# EAGLE schematic slice_v6_zp (EAGLE 7.4.0)
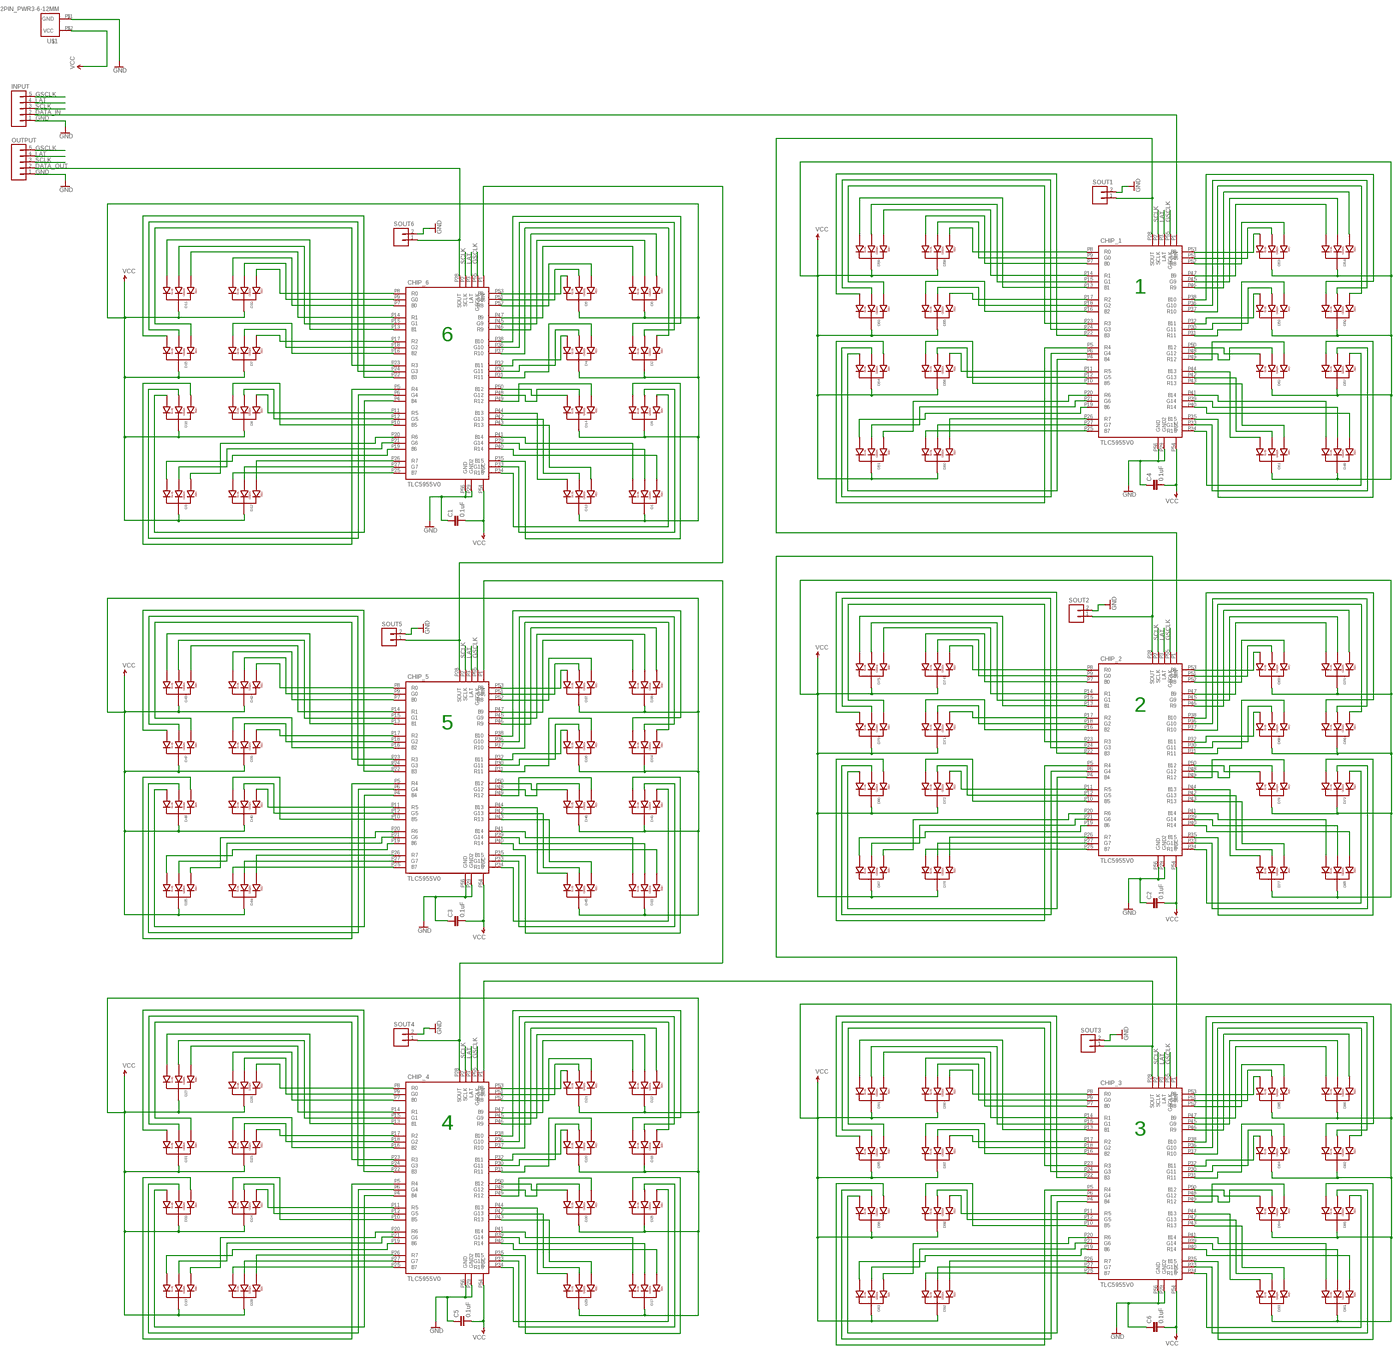
[diagram p0: schematic, sheet 1, overview]
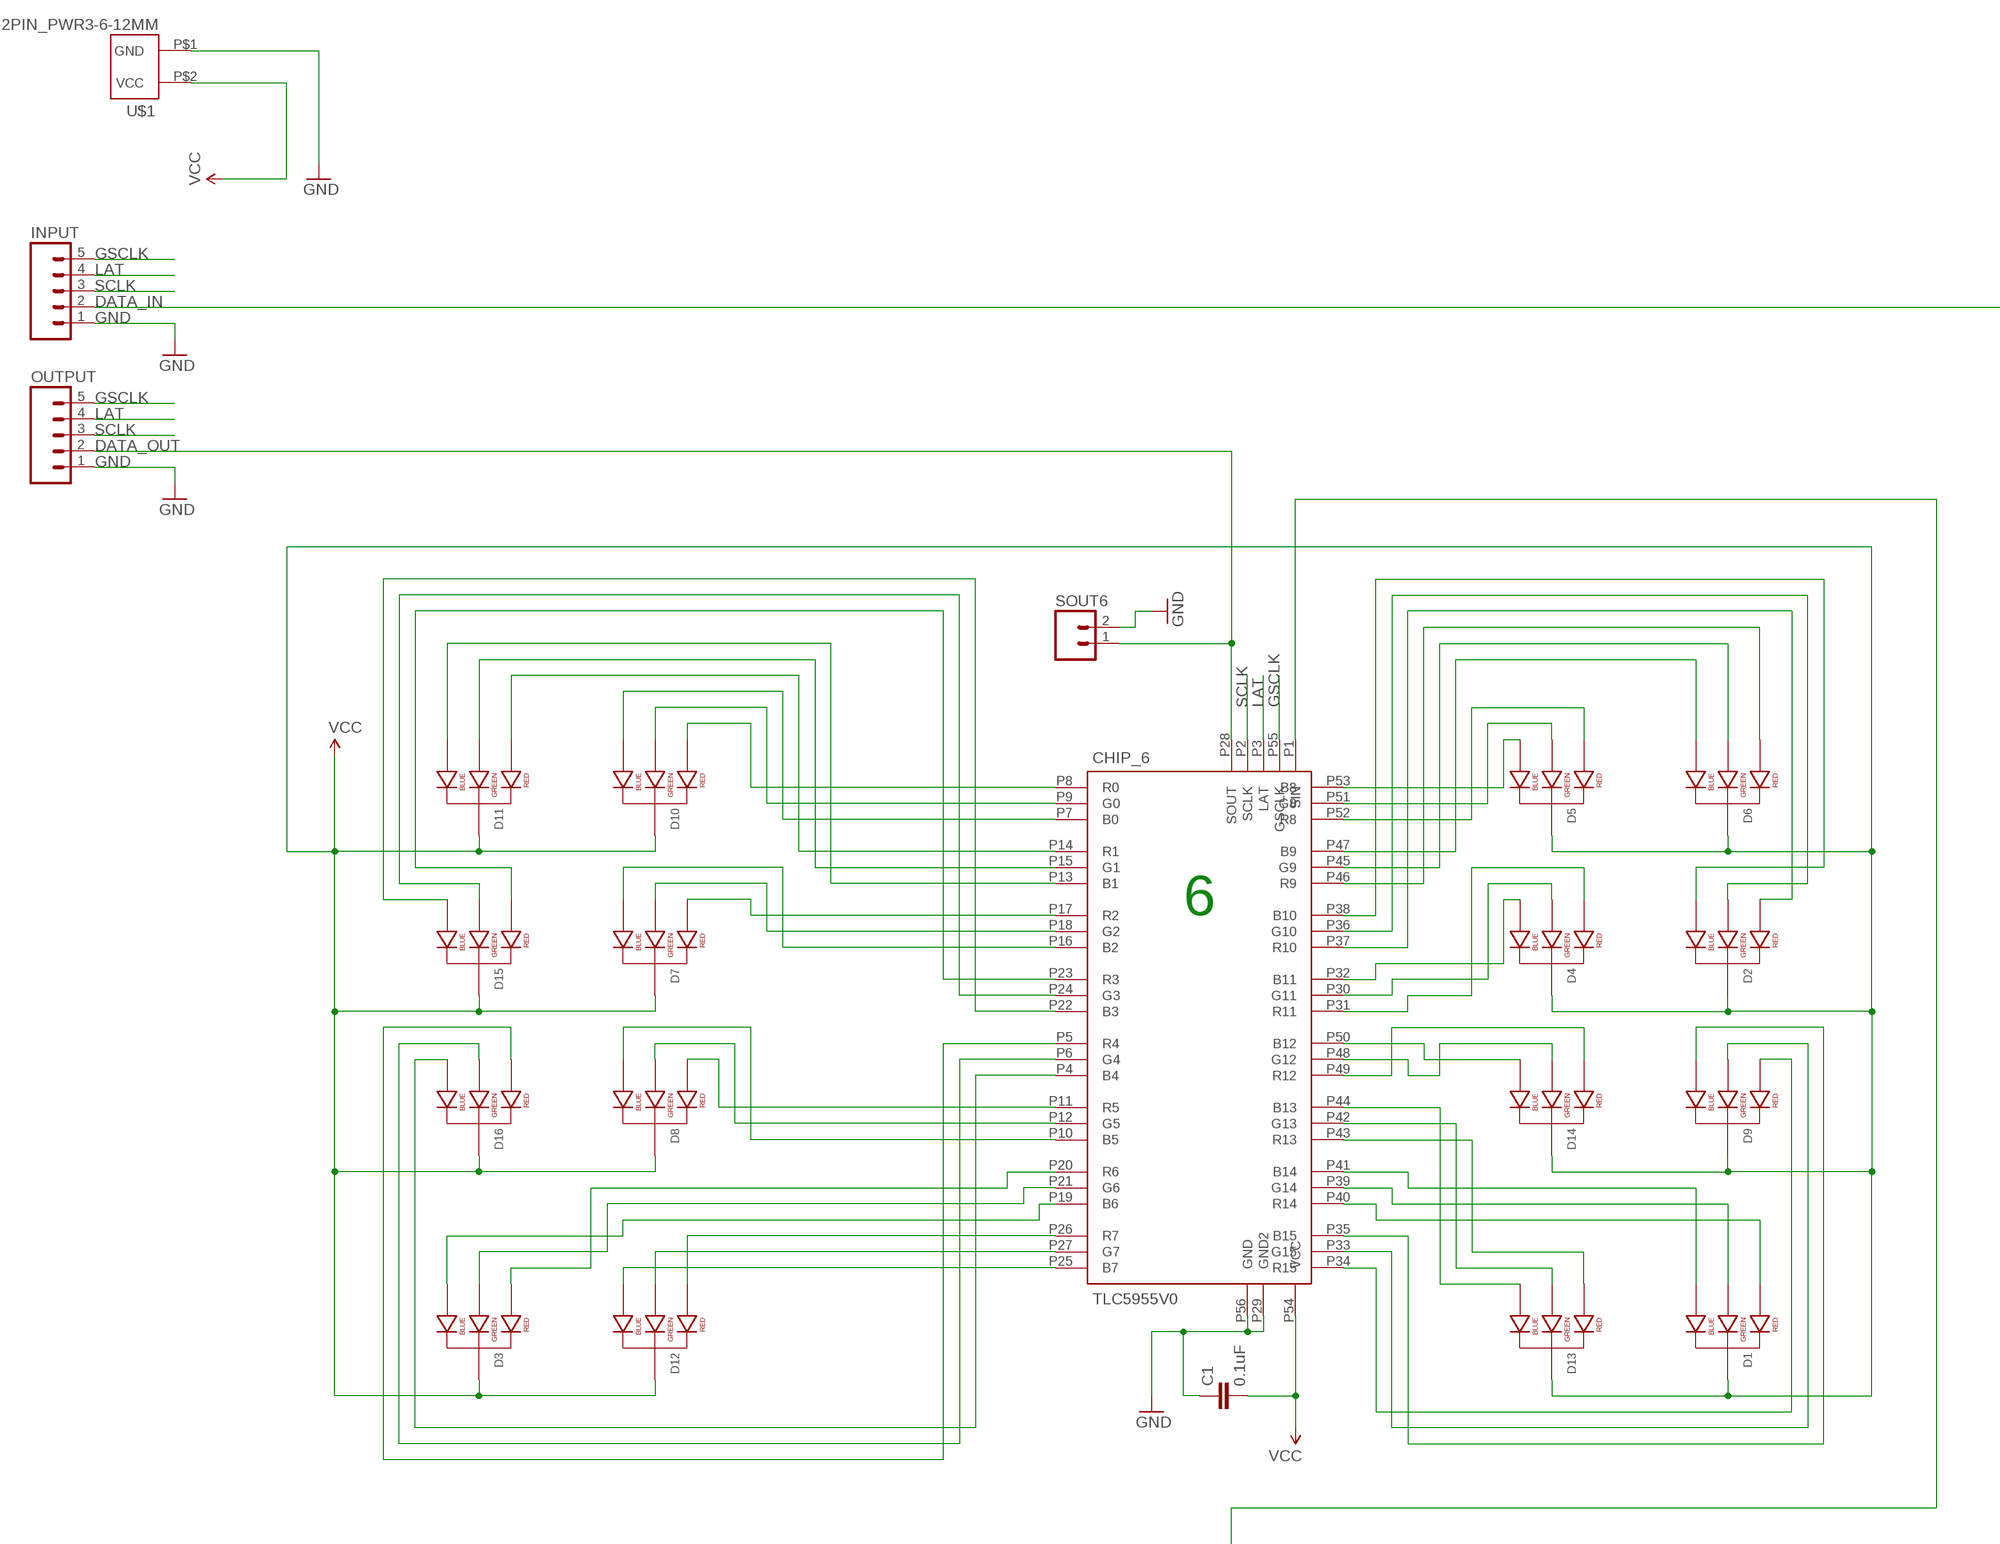
[diagram p1: schematic, sheet 1, part 1 of 4]
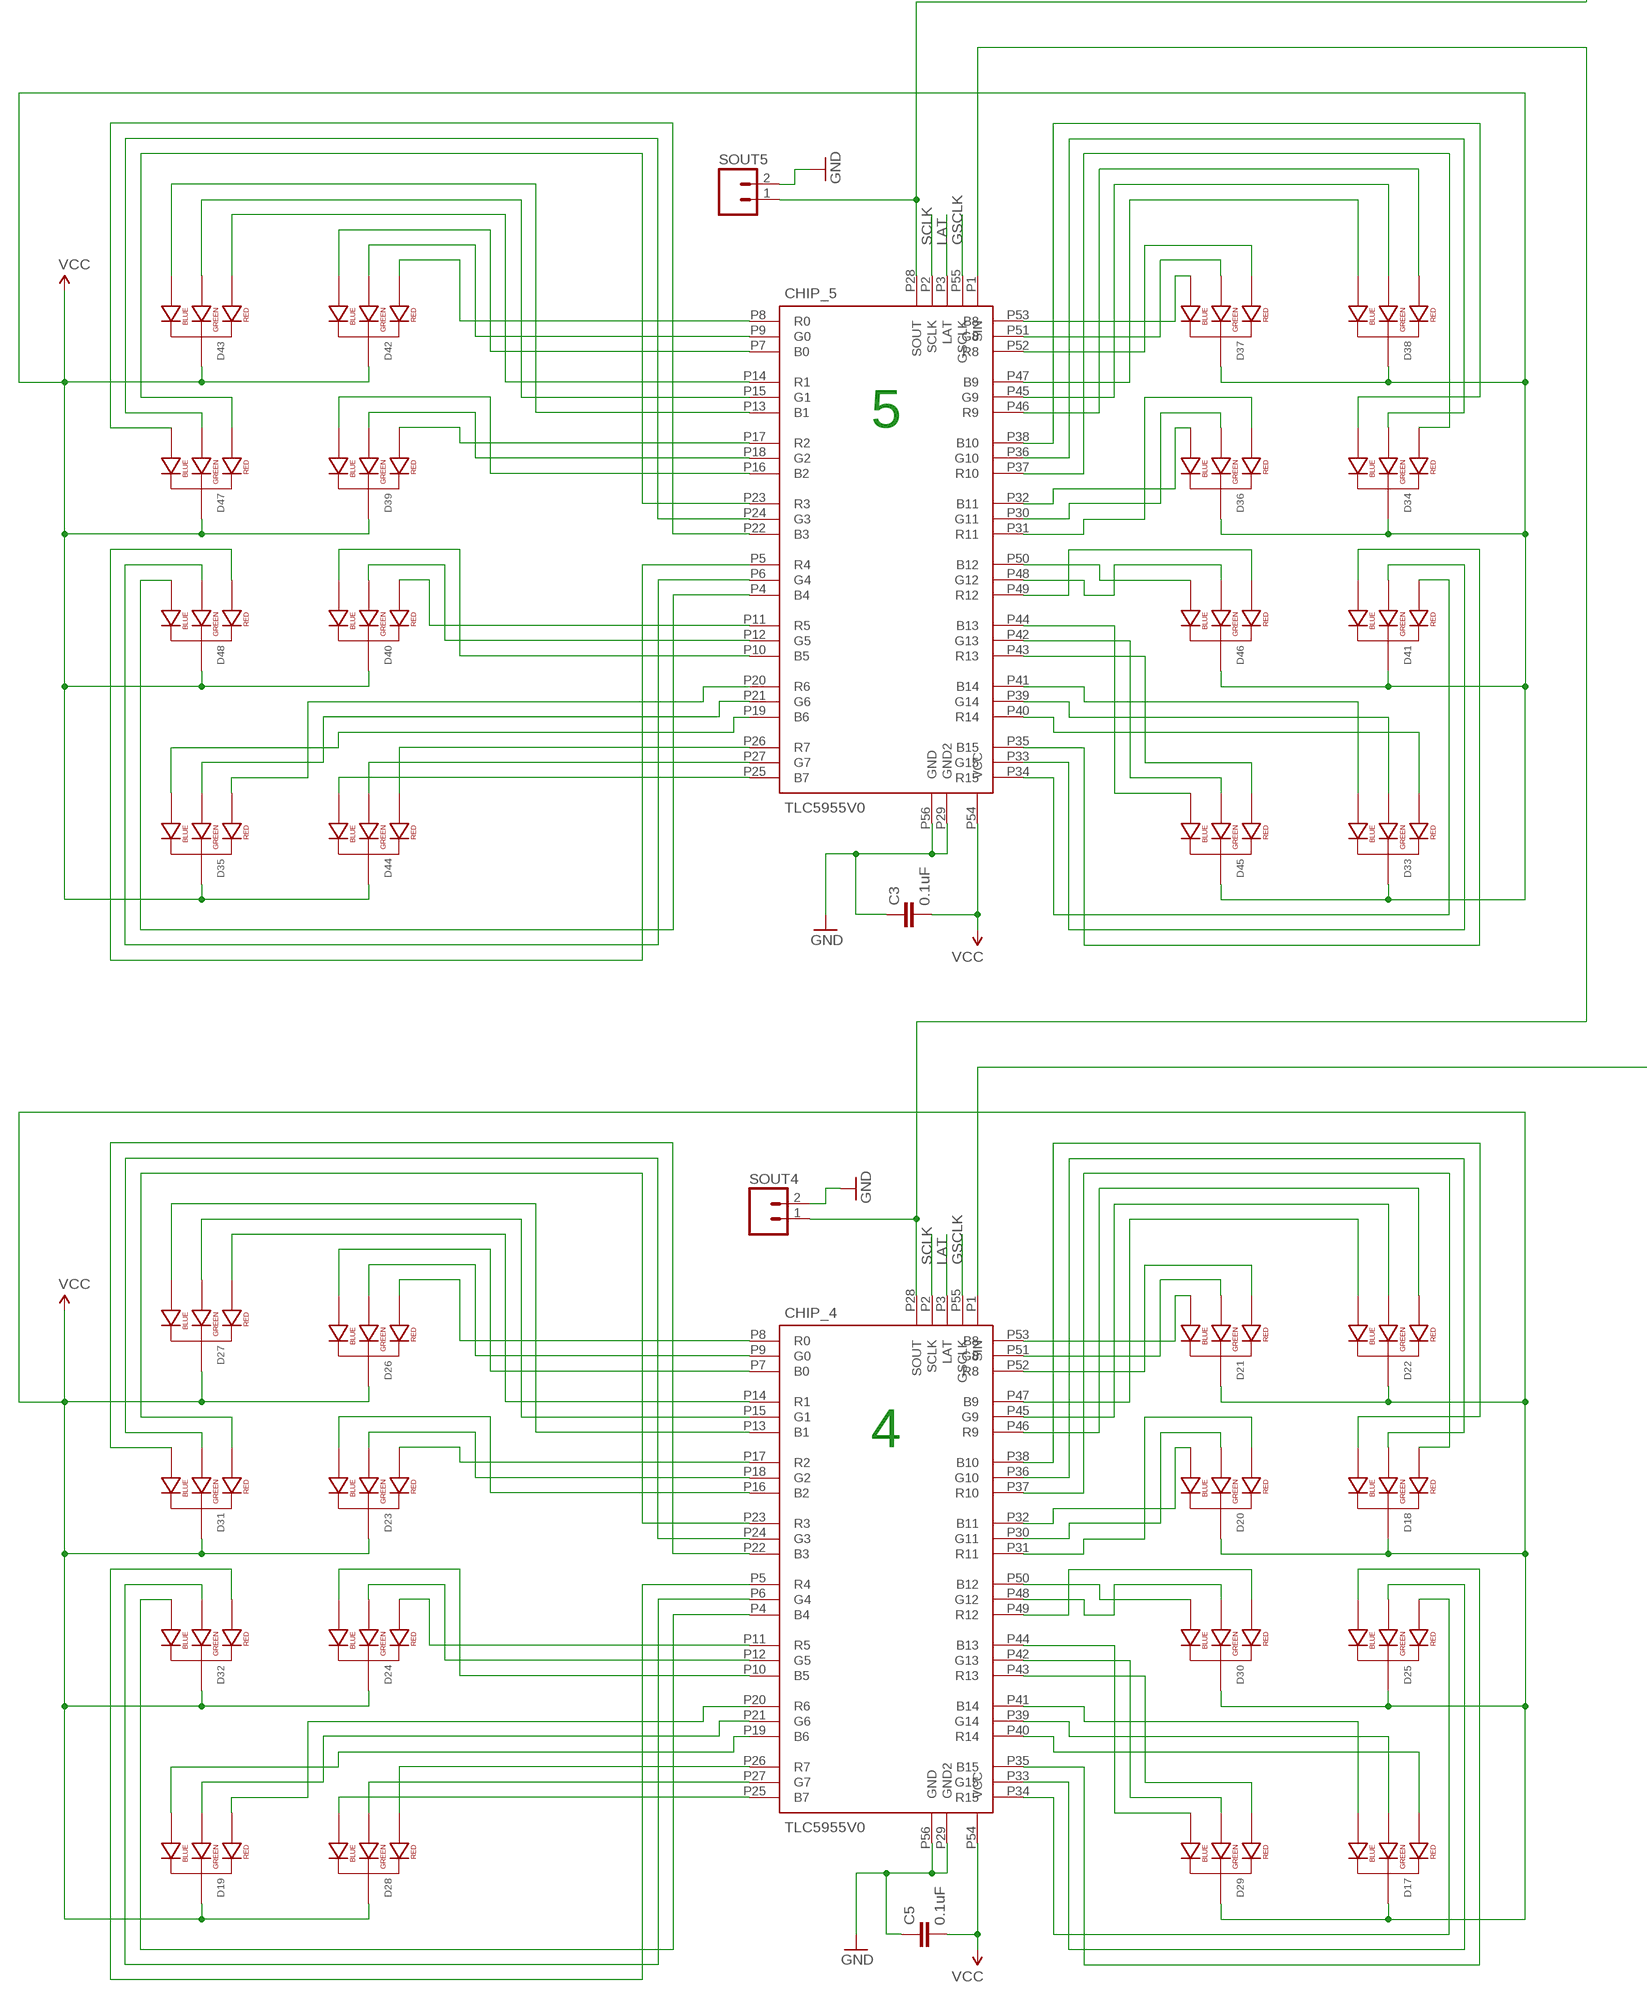
[diagram p2: schematic, sheet 1, part 2 of 4]
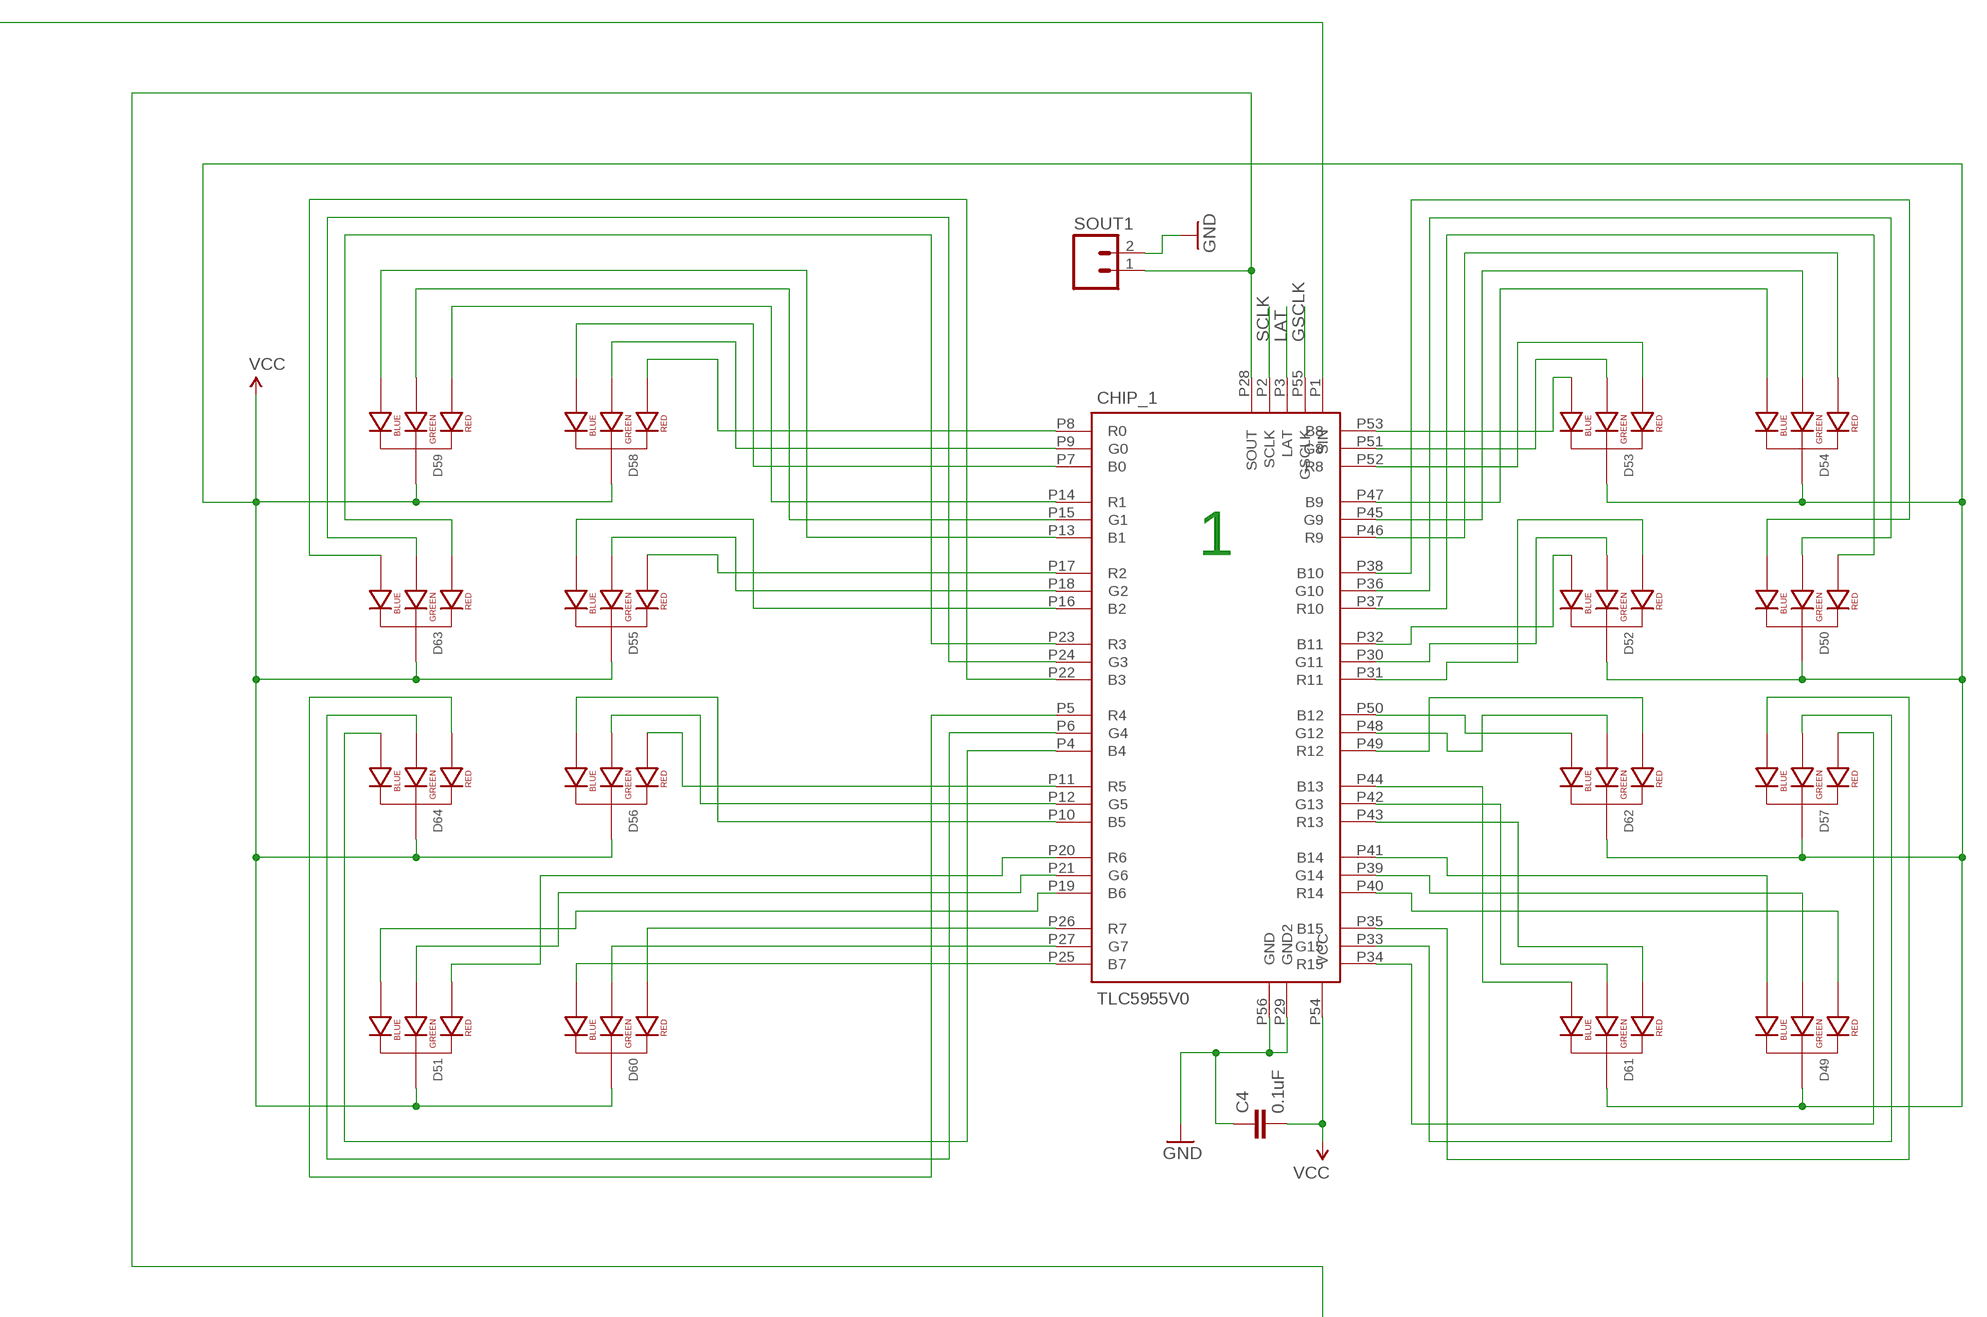
[diagram p3: schematic, sheet 1, part 3 of 4]
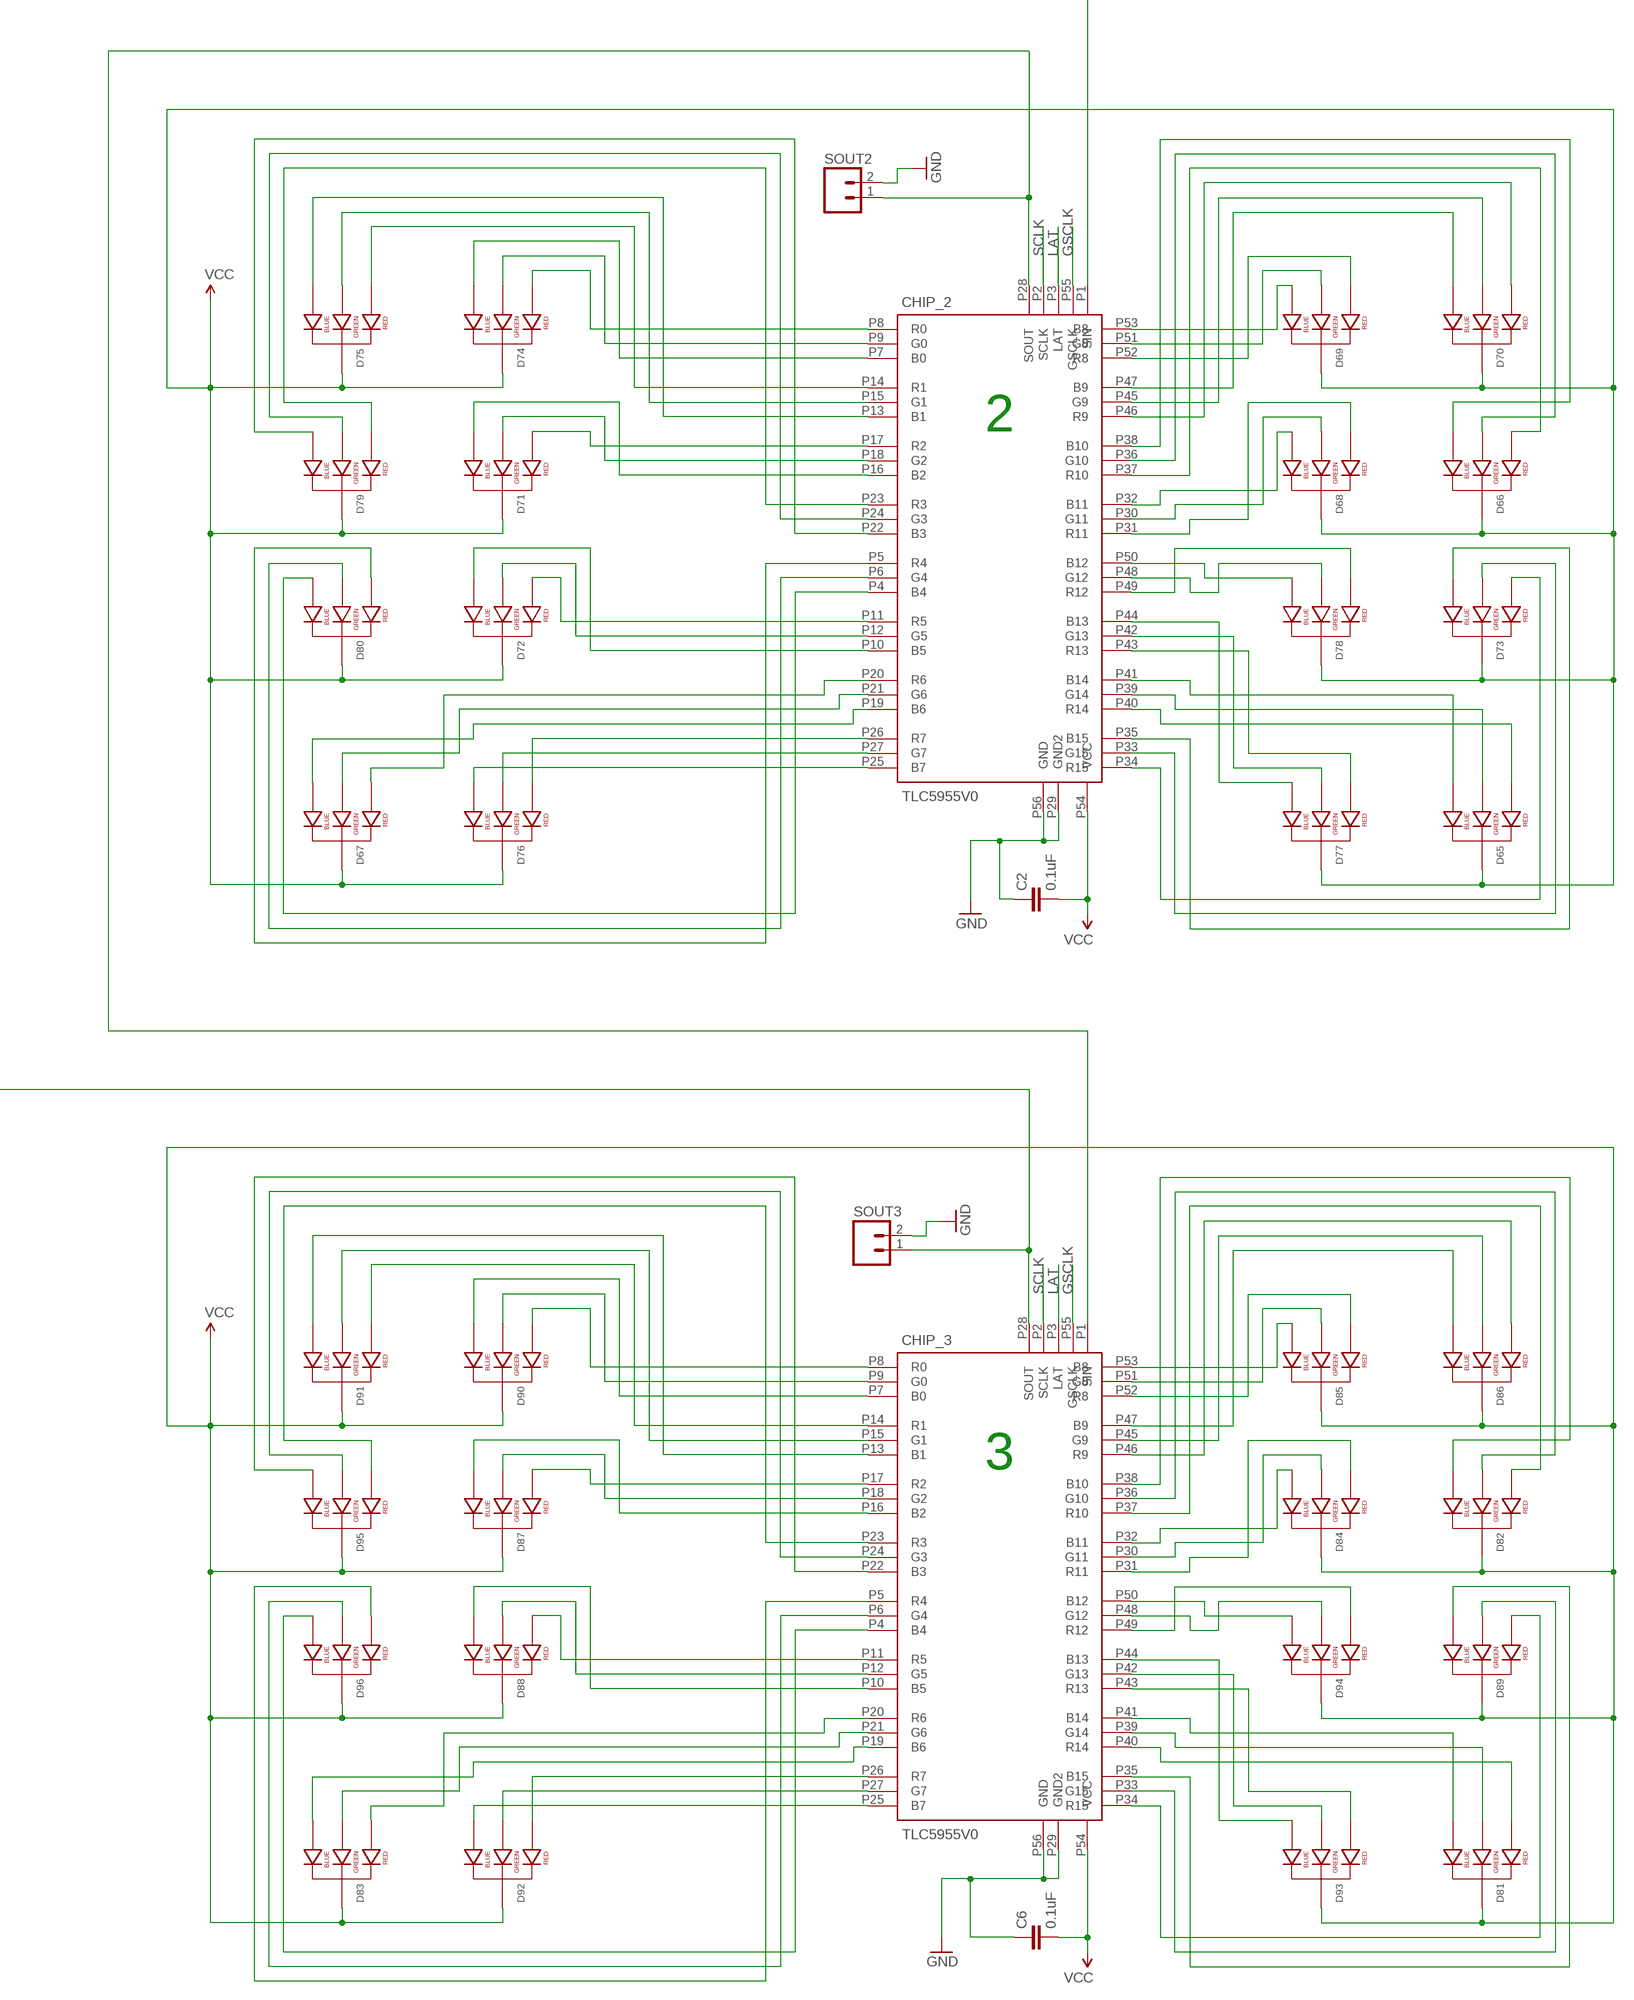
[diagram p4: schematic, sheet 1, part 4 of 4]

## Parts
C1  0.1uF  0.1UF-25V(+80/-20%)(0603)  [0603-CAP]
C2  0.1uF  0.1UF-25V(+80/-20%)(0603)  [0603-CAP]
C3  0.1uF  0.1UF-25V(+80/-20%)(0603)  [0603-CAP]
C4  0.1uF  0.1UF-25V(+80/-20%)(0603)  [0603-CAP]
C5  0.1uF  0.1UF-25V(+80/-20%)(0603)  [0603-CAP]
C6  0.1uF  0.1UF-25V(+80/-20%)(0603)  [0603-CAP]
CHIP_1  TLC5955V0  [56-HTSSOP]
CHIP_2  TLC5955V0  [56-HTSSOP]
CHIP_3  TLC5955V0  [56-HTSSOP]
CHIP_4  TLC5955V0  [56-HTSSOP]
CHIP_5  TLC5955V0  [56-HTSSOP]
CHIP_6  TLC5955V0  [56-HTSSOP]
D1  LED-RGB-CC-THRUCLEAR  [LED-RGB-THRU]
D2  LED-RGB-CC-THRUCLEAR  [LED-RGB-THRU]
D3  LED-RGB-CC-THRUCLEAR  [LED-RGB-THRU]
D4  LED-RGB-CC-THRUCLEAR  [LED-RGB-THRU]
D5  LED-RGB-CC-THRUCLEAR  [LED-RGB-THRU]
D6  LED-RGB-CC-THRUCLEAR  [LED-RGB-THRU]
D7  LED-RGB-CC-THRUCLEAR  [LED-RGB-THRU]
D8  LED-RGB-CC-THRUCLEAR  [LED-RGB-THRU]
D9  LED-RGB-CC-THRUCLEAR  [LED-RGB-THRU]
D10  LED-RGB-CC-THRUCLEAR  [LED-RGB-THRU]
D11  LED-RGB-CC-THRUDIFFUSE  LED-RGB-CC-THRUCLEAR  [LED-RGB-THRU]
D12  LED-RGB-CC-THRUCLEAR  [LED-RGB-THRU]
D13  LED-RGB-CC-THRUCLEAR  [LED-RGB-THRU]
D14  LED-RGB-CC-THRUCLEAR  [LED-RGB-THRU]
D15  LED-RGB-CC-THRUCLEAR  [LED-RGB-THRU]
D16  LED-RGB-CC-THRUCLEAR  [LED-RGB-THRU]
D17  LED-RGB-CC-THRUCLEAR  [LED-RGB-THRU]
D18  LED-RGB-CC-THRUCLEAR  [LED-RGB-THRU]
D19  LED-RGB-CC-THRUCLEAR  [LED-RGB-THRU]
D20  LED-RGB-CC-THRUCLEAR  [LED-RGB-THRU]
D21  LED-RGB-CC-THRUCLEAR  [LED-RGB-THRU]
D22  LED-RGB-CC-THRUCLEAR  [LED-RGB-THRU]
D23  LED-RGB-CC-THRUCLEAR  [LED-RGB-THRU]
D24  LED-RGB-CC-THRUCLEAR  [LED-RGB-THRU]
D25  LED-RGB-CC-THRUCLEAR  [LED-RGB-THRU]
D26  LED-RGB-CC-THRUCLEAR  [LED-RGB-THRU]
D27  LED-RGB-CC-THRUCLEAR  [LED-RGB-THRU]
D28  LED-RGB-CC-THRUCLEAR  [LED-RGB-THRU]
D29  LED-RGB-CC-THRUCLEAR  [LED-RGB-THRU]
D30  LED-RGB-CC-THRUCLEAR  [LED-RGB-THRU]
D31  LED-RGB-CC-THRUCLEAR  [LED-RGB-THRU]
D32  LED-RGB-CC-THRUCLEAR  [LED-RGB-THRU]
D33  LED-RGB-CC-THRUCLEAR  [LED-RGB-THRU]
D34  LED-RGB-CC-THRUCLEAR  [LED-RGB-THRU]
D35  1  LED-RGB-CC-THRUCLEAR  [LED-RGB-THRU]
D36  LED-RGB-CC-THRUCLEAR  [LED-RGB-THRU]
D37  LED-RGB-CC-THRUCLEAR  [LED-RGB-THRU]
D38  LED-RGB-CC-THRUCLEAR  [LED-RGB-THRU]
D39  LED-RGB-CC-THRUCLEAR  [LED-RGB-THRU]
D40  LED-RGB-CC-THRUCLEAR  [LED-RGB-THRU]
D41  LED-RGB-CC-THRUCLEAR  [LED-RGB-THRU]
D42  LED-RGB-CC-THRUCLEAR  [LED-RGB-THRU]
D43  LED-RGB-CC-THRUCLEAR  [LED-RGB-THRU]
D44  LED-RGB-CC-THRUCLEAR  [LED-RGB-THRU]
D45  LED-RGB-CC-THRUCLEAR  [LED-RGB-THRU]
D46  LED-RGB-CC-THRUCLEAR  [LED-RGB-THRU]
D47  LED-RGB-CC-THRUCLEAR  [LED-RGB-THRU]
D48  LED-RGB-CC-THRUCLEAR  [LED-RGB-THRU]
D49  LED-RGB-CC-THRUCLEAR  [LED-RGB-THRU]
D50  LED-RGB-CC-THRUCLEAR  [LED-RGB-THRU]
D51  LED-RGB-CC-THRUCLEAR  [LED-RGB-THRU]
D52  LED-RGB-CC-THRUCLEAR  [LED-RGB-THRU]
D53  LED-RGB-CC-THRUCLEAR  [LED-RGB-THRU]
D54  LED-RGB-CC-THRUCLEAR  [LED-RGB-THRU]
D55  LED-RGB-CC-THRUCLEAR  [LED-RGB-THRU]
D56  LED-RGB-CC-THRUCLEAR  [LED-RGB-THRU]
D57  LED-RGB-CC-THRUCLEAR  [LED-RGB-THRU]
D58  LED-RGB-CC-THRUCLEAR  [LED-RGB-THRU]
D59  LED-RGB-CC-THRUCLEAR  [LED-RGB-THRU]
D60  LED-RGB-CC-THRUCLEAR  [LED-RGB-THRU]
D61  LED-RGB-CC-THRUCLEAR  [LED-RGB-THRU]
D62  LED-RGB-CC-THRUCLEAR  [LED-RGB-THRU]
D63  LED-RGB-CC-THRUCLEAR  [LED-RGB-THRU]
D64  LED-RGB-CC-THRUCLEAR  [LED-RGB-THRU]
D65  LED-RGB-CC-THRUCLEAR  [LED-RGB-THRU]
D66  LED-RGB-CC-THRUCLEAR  [LED-RGB-THRU]
D67  LED-RGB-CC-THRUCLEAR  [LED-RGB-THRU]
D68  LED-RGB-CC-THRUCLEAR  [LED-RGB-THRU]
D69  LED-RGB-CC-THRUCLEAR  [LED-RGB-THRU]
D70  LED-RGB-CC-THRUCLEAR  [LED-RGB-THRU]
D71  LED-RGB-CC-THRUCLEAR  [LED-RGB-THRU]
D72  LED-RGB-CC-THRUCLEAR  [LED-RGB-THRU]
D73  LED-RGB-CC-THRUCLEAR  [LED-RGB-THRU]
D74  LED-RGB-CC-THRUCLEAR  [LED-RGB-THRU]
D75  LED-RGB-CC-THRUCLEAR  [LED-RGB-THRU]
D76  LED-RGB-CC-THRUCLEAR  [LED-RGB-THRU]
D77  LED-RGB-CC-THRUCLEAR  [LED-RGB-THRU]
D78  LED-RGB-CC-THRUCLEAR  [LED-RGB-THRU]
D79  LED-RGB-CC-THRUCLEAR  [LED-RGB-THRU]
D80  LED-RGB-CC-THRUCLEAR  [LED-RGB-THRU]
D81  LED-RGB-CC-THRUCLEAR  [LED-RGB-THRU]
D82  LED-RGB-CC-THRUCLEAR  [LED-RGB-THRU]
D83  LED-RGB-CC-THRUCLEAR  [LED-RGB-THRU]
D84  LED-RGB-CC-THRUCLEAR  [LED-RGB-THRU]
D85  LED-RGB-CC-THRUCLEAR  [LED-RGB-THRU]
D86  LED-RGB-CC-THRUCLEAR  [LED-RGB-THRU]
D87  LED-RGB-CC-THRUCLEAR  [LED-RGB-THRU]
D88  LED-RGB-CC-THRUCLEAR  [LED-RGB-THRU]
D89  LED-RGB-CC-THRUCLEAR  [LED-RGB-THRU]
D90  LED-RGB-CC-THRUCLEAR  [LED-RGB-THRU]
D91  LED-RGB-CC-THRUCLEAR  [LED-RGB-THRU]
D92  LED-RGB-CC-THRUCLEAR  [LED-RGB-THRU]
D93  LED-RGB-CC-THRUCLEAR  [LED-RGB-THRU]
D94  LED-RGB-CC-THRUCLEAR  [LED-RGB-THRU]
D95  LED-RGB-CC-THRUCLEAR  [LED-RGB-THRU]
D96  LED-RGB-CC-THRUCLEAR  [LED-RGB-THRU]
INPUT  M05LOCK_LONGPADS  [1X05_LOCK_LONGPADS]
OUTPUT  M05LOCK_LONGPADS  [1X05_LOCK_LONGPADS]
SOUT1  M02LOCK  [1X02_LOCK]
SOUT2  M02LOCK  [1X02_LOCK]
SOUT3  M02LOCK  [1X02_LOCK]
SOUT4  M02LOCK  [1X02_LOCK]
SOUT5  M02LOCK  [1X02_LOCK]
SOUT6  M02LOCK  [1X02_LOCK]
U$1  2PIN_PWR3-6-12MM  [2PIN_HOLES_PWR]

## Nets
DATA_IN: CHIP_1.P1(SIN) INPUT.2
DATA_OUT: CHIP_6.P28(SOUT) OUTPUT.2 SOUT6.1
GND: C1.1 C2.1 C3.1 C4.1 C5.1 C6.1 CHIP_1.P29(GND2) CHIP_1.P56(GND) CHIP_2.P29(GND2) CHIP_2.P56(GND) CHIP_3.P29(GND2) CHIP_3.P56(GND) CHIP_4.P29(GND2) CHIP_4.P56(GND) CHIP_5.P29(GND2) CHIP_5.P56(GND) CHIP_6.P29(GND2) CHIP_6.P56(GND) INPUT.1 OUTPUT.1 SOUT1.2 SOUT2.2 SOUT3.2 SOUT4.2 SOUT5.2 SOUT6.2 U$1.P$1(GND)
GSCLK: CHIP_1.P55(GSCLK) CHIP_2.P55(GSCLK) CHIP_3.P55(GSCLK) CHIP_4.P55(GSCLK) CHIP_5.P55(GSCLK) CHIP_6.P55(GSCLK) INPUT.5 OUTPUT.5
LAT: CHIP_1.P3(LAT) CHIP_2.P3(LAT) CHIP_3.P3(LAT) CHIP_4.P3(LAT) CHIP_5.P3(LAT) CHIP_6.P3(LAT) INPUT.4 OUTPUT.4
N$1: CHIP_6.P8(R0) D10.3(RED_CATHODE)
N$2: CHIP_6.P20(R6) D3.3(RED_CATHODE)
N$3: CHIP_6.P7(B0) D10.4(BLUE_CATHODE)
N$4: CHIP_6.P17(R2) D7.3(RED_CATHODE)
N$5: CHIP_6.P18(G2) D7.1(GREEN_CATHODE)
N$6: CHIP_6.P16(B2) D7.4(BLUE_CATHODE)
N$7: CHIP_6.P14(R1) D11.3(RED_CATHODE)
N$8: CHIP_6.P34(R15) D9.3(RED_CATHODE)
N$9: CHIP_6.P15(G1) D11.1(GREEN_CATHODE)
N$10: CHIP_6.P13(B1) D11.4(BLUE_CATHODE)
N$11: CHIP_6.P26(R7) D12.3(RED_CATHODE)
N$12: CHIP_6.P27(G7) D12.1(GREEN_CATHODE)
N$13: CHIP_6.P25(B7) D12.4(BLUE_CATHODE)
N$14: CHIP_6.P11(R5) D8.3(RED_CATHODE)
N$15: CHIP_6.P12(G5) D8.1(GREEN_CATHODE)
N$16: CHIP_6.P10(B5) D8.4(BLUE_CATHODE)
N$17: CHIP_6.P21(G6) D3.1(GREEN_CATHODE)
N$18: CHIP_6.P19(B6) D3.4(BLUE_CATHODE)
N$19: CHIP_6.P4(B4) D16.4(BLUE_CATHODE)
N$20: CHIP_6.P6(G4) D16.1(GREEN_CATHODE)
N$21: CHIP_6.P5(R4) D16.3(RED_CATHODE)
N$22: CHIP_6.P23(R3) D15.3(RED_CATHODE)
N$23: CHIP_6.P24(G3) D15.1(GREEN_CATHODE)
N$24: CHIP_6.P22(B3) D15.4(BLUE_CATHODE)
N$25: CHIP_6.P33(G15) D9.1(GREEN_CATHODE)
N$26: CHIP_6.P30(G11) D4.1(GREEN_CATHODE)
N$27: CHIP_6.P31(R11) D4.3(RED_CATHODE)
N$28: CHIP_6.P51(G8) D5.1(GREEN_CATHODE)
N$29: CHIP_6.P53(B8) D5.4(BLUE_CATHODE)
N$30: CHIP_6.P35(B15) D9.4(BLUE_CATHODE)
N$31: CHIP_6.P52(R8) D5.3(RED_CATHODE)
N$32: CHIP_6.P47(B9) D6.4(BLUE_CATHODE)
N$33: CHIP_6.P45(G9) D6.1(GREEN_CATHODE)
N$34: CHIP_6.P40(R14) D1.3(RED_CATHODE)
N$35: CHIP_6.P37(R10) D2.3(RED_CATHODE)
N$36: CHIP_6.P48(G12) D14.1(GREEN_CATHODE)
N$37: CHIP_6.P41(B14) D1.4(BLUE_CATHODE)
N$38: CHIP_6.P46(R9) D6.3(RED_CATHODE)
N$39: CHIP_6.P43(R13) D13.3(RED_CATHODE)
N$40: CHIP_6.P42(G13) D13.1(GREEN_CATHODE)
N$41: CHIP_6.P44(B13) D13.4(BLUE_CATHODE)
N$42: CHIP_6.P36(G10) D2.1(GREEN_CATHODE)
N$43: CHIP_6.P38(B10) D2.4(BLUE_CATHODE)
N$44: CHIP_6.P32(B11) D4.4(BLUE_CATHODE)
N$45: CHIP_4.P8(R0) D26.3(RED_CATHODE)
N$46: CHIP_6.P50(B12) D14.4(BLUE_CATHODE)
N$47: CHIP_6.P49(R12) D14.3(RED_CATHODE)
N$48: CHIP_4.P7(B0) D26.4(BLUE_CATHODE)
N$49: CHIP_6.P39(G14) D1.1(GREEN_CATHODE)
N$50: CHIP_4.P17(R2) D23.3(RED_CATHODE)
N$51: CHIP_4.P18(G2) D23.1(GREEN_CATHODE)
N$52: CHIP_4.P16(B2) D23.4(BLUE_CATHODE)
N$53: CHIP_4.P14(R1) D27.3(RED_CATHODE)
N$54: CHIP_4.P15(G1) D27.1(GREEN_CATHODE)
N$55: CHIP_4.P13(B1) D27.4(BLUE_CATHODE)
N$56: CHIP_4.P26(R7) D28.3(RED_CATHODE)
N$57: CHIP_4.P27(G7) D28.1(GREEN_CATHODE)
N$58: CHIP_4.P25(B7) D28.4(BLUE_CATHODE)
N$59: CHIP_4.P11(R5) D24.3(RED_CATHODE)
N$60: CHIP_4.P12(G5) D24.1(GREEN_CATHODE)
N$61: CHIP_4.P10(B5) D24.4(BLUE_CATHODE)
N$62: CHIP_4.P20(R6) D19.3(RED_CATHODE)
N$63: CHIP_4.P21(G6) D19.1(GREEN_CATHODE)
N$64: CHIP_4.P19(B6) D19.4(BLUE_CATHODE)
N$65: CHIP_4.P4(B4) D32.4(BLUE_CATHODE)
N$66: CHIP_4.P6(G4) D32.1(GREEN_CATHODE)
N$67: CHIP_4.P5(R4) D32.3(RED_CATHODE)
N$68: CHIP_4.P23(R3) D31.3(RED_CATHODE)
N$69: CHIP_4.P24(G3) D31.1(GREEN_CATHODE)
N$70: CHIP_4.P22(B3) D31.4(BLUE_CATHODE)
N$71: CHIP_4.P53(B8) D21.4(BLUE_CATHODE)
N$72: CHIP_4.P52(R8) D21.3(RED_CATHODE)
N$73: CHIP_4.P47(B9) D22.4(BLUE_CATHODE)
N$74: CHIP_4.P45(G9) D22.1(GREEN_CATHODE)
N$75: CHIP_4.P37(R10) D18.3(RED_CATHODE)
N$76: CHIP_4.P30(G11) D20.1(GREEN_CATHODE)
N$77: CHIP_4.P31(R11) D20.3(RED_CATHODE)
N$78: CHIP_4.P51(G8) D21.1(GREEN_CATHODE)
N$79: CHIP_4.P46(R9) D22.3(RED_CATHODE)
N$80: CHIP_4.P36(G10) D18.1(GREEN_CATHODE)
N$81: CHIP_4.P38(B10) D18.4(BLUE_CATHODE)
N$82: CHIP_4.P32(B11) D20.4(BLUE_CATHODE)
N$83: CHIP_4.P34(R15) D25.3(RED_CATHODE)
N$84: CHIP_4.P33(G15) D25.1(GREEN_CATHODE)
N$85: CHIP_4.P35(B15) D25.4(BLUE_CATHODE)
N$86: CHIP_4.P40(R14) D17.3(RED_CATHODE)
N$87: CHIP_4.P41(B14) D17.4(BLUE_CATHODE)
N$88: CHIP_4.P43(R13) D29.3(RED_CATHODE)
N$89: CHIP_4.P42(G13) D29.1(GREEN_CATHODE)
N$90: CHIP_4.P44(B13) D29.4(BLUE_CATHODE)
N$91: CHIP_4.P50(B12) D30.4(BLUE_CATHODE)
N$92: CHIP_4.P49(R12) D30.3(RED_CATHODE)
N$93: CHIP_4.P39(G14) D17.1(GREEN_CATHODE)
N$94: CHIP_4.P48(G12) D30.1(GREEN_CATHODE)
N$95: CHIP_5.P8(R0) D42.3(RED_CATHODE)
N$96: CHIP_5.P7(B0) D42.4(BLUE_CATHODE)
N$97: CHIP_5.P17(R2) D39.3(RED_CATHODE)
N$98: CHIP_5.P18(G2) D39.1(GREEN_CATHODE)
N$99: CHIP_5.P16(B2) D39.4(BLUE_CATHODE)
N$100: CHIP_5.P14(R1) D43.3(RED_CATHODE)
N$101: CHIP_5.P15(G1) D43.1(GREEN_CATHODE)
N$102: CHIP_5.P13(B1) D43.4(BLUE_CATHODE)
N$103: CHIP_5.P26(R7) D44.3(RED_CATHODE)
N$104: CHIP_5.P27(G7) D44.1(GREEN_CATHODE)
N$105: CHIP_5.P25(B7) D44.4(BLUE_CATHODE)
N$106: CHIP_5.P11(R5) D40.3(RED_CATHODE)
N$107: CHIP_5.P12(G5) D40.1(GREEN_CATHODE)
N$108: CHIP_5.P10(B5) D40.4(BLUE_CATHODE)
N$109: CHIP_5.P20(R6) D35.3(RED_CATHODE)
N$110: CHIP_5.P21(G6) D35.1(GREEN_CATHODE)
N$111: CHIP_5.P19(B6) D35.4(BLUE_CATHODE)
N$112: CHIP_5.P4(B4) D48.4(BLUE_CATHODE)
N$113: CHIP_5.P6(G4) D48.1(GREEN_CATHODE)
N$114: CHIP_5.P5(R4) D48.3(RED_CATHODE)
N$115: CHIP_5.P23(R3) D47.3(RED_CATHODE)
N$116: CHIP_5.P24(G3) D47.1(GREEN_CATHODE)
N$117: CHIP_5.P22(B3) D47.4(BLUE_CATHODE)
N$118: CHIP_5.P53(B8) D37.4(BLUE_CATHODE)
N$119: CHIP_5.P52(R8) D37.3(RED_CATHODE)
N$120: CHIP_5.P47(B9) D38.4(BLUE_CATHODE)
N$121: CHIP_5.P45(G9) D38.1(GREEN_CATHODE)
N$122: CHIP_5.P37(R10) D34.3(RED_CATHODE)
N$123: CHIP_5.P30(G11) D36.1(GREEN_CATHODE)
N$124: CHIP_5.P31(R11) D36.3(RED_CATHODE)
N$125: CHIP_5.P51(G8) D37.1(GREEN_CATHODE)
N$126: CHIP_5.P46(R9) D38.3(RED_CATHODE)
N$127: CHIP_5.P36(G10) D34.1(GREEN_CATHODE)
N$128: CHIP_5.P38(B10) D34.4(BLUE_CATHODE)
N$129: CHIP_5.P32(B11) D36.4(BLUE_CATHODE)
N$130: CHIP_5.P34(R15) D41.3(RED_CATHODE)
N$131: CHIP_5.P33(G15) D41.1(GREEN_CATHODE)
N$132: CHIP_5.P35(B15) D41.4(BLUE_CATHODE)
N$133: CHIP_5.P40(R14) D33.3(RED_CATHODE)
N$134: CHIP_5.P41(B14) D33.4(BLUE_CATHODE)
N$135: CHIP_5.P43(R13) D45.3(RED_CATHODE)
N$136: CHIP_5.P42(G13) D45.1(GREEN_CATHODE)
N$137: CHIP_5.P44(B13) D45.4(BLUE_CATHODE)
N$138: CHIP_5.P50(B12) D46.4(BLUE_CATHODE)
N$139: CHIP_5.P49(R12) D46.3(RED_CATHODE)
N$140: CHIP_5.P39(G14) D33.1(GREEN_CATHODE)
N$141: CHIP_5.P48(G12) D46.1(GREEN_CATHODE)
N$142: CHIP_1.P8(R0) D58.3(RED_CATHODE)
N$143: CHIP_1.P7(B0) D58.4(BLUE_CATHODE)
N$144: CHIP_1.P17(R2) D55.3(RED_CATHODE)
N$145: CHIP_1.P18(G2) D55.1(GREEN_CATHODE)
N$146: CHIP_1.P16(B2) D55.4(BLUE_CATHODE)
N$147: CHIP_1.P14(R1) D59.3(RED_CATHODE)
N$148: CHIP_1.P15(G1) D59.1(GREEN_CATHODE)
N$149: CHIP_1.P13(B1) D59.4(BLUE_CATHODE)
N$150: CHIP_1.P26(R7) D60.3(RED_CATHODE)
N$151: CHIP_1.P27(G7) D60.1(GREEN_CATHODE)
N$152: CHIP_1.P25(B7) D60.4(BLUE_CATHODE)
N$153: CHIP_1.P11(R5) D56.3(RED_CATHODE)
N$154: CHIP_1.P12(G5) D56.1(GREEN_CATHODE)
N$155: CHIP_1.P10(B5) D56.4(BLUE_CATHODE)
N$156: CHIP_1.P20(R6) D51.3(RED_CATHODE)
N$157: CHIP_1.P21(G6) D51.1(GREEN_CATHODE)
N$158: CHIP_1.P19(B6) D51.4(BLUE_CATHODE)
N$159: CHIP_1.P4(B4) D64.4(BLUE_CATHODE)
N$160: CHIP_1.P6(G4) D64.1(GREEN_CATHODE)
N$161: CHIP_1.P5(R4) D64.3(RED_CATHODE)
N$162: CHIP_1.P23(R3) D63.3(RED_CATHODE)
N$163: CHIP_1.P24(G3) D63.1(GREEN_CATHODE)
N$164: CHIP_1.P22(B3) D63.4(BLUE_CATHODE)
N$165: CHIP_1.P53(B8) D53.4(BLUE_CATHODE)
N$166: CHIP_1.P52(R8) D53.3(RED_CATHODE)
N$167: CHIP_1.P47(B9) D54.4(BLUE_CATHODE)
N$168: CHIP_1.P45(G9) D54.1(GREEN_CATHODE)
N$169: CHIP_1.P37(R10) D50.3(RED_CATHODE)
N$170: CHIP_1.P30(G11) D52.1(GREEN_CATHODE)
N$171: CHIP_1.P31(R11) D52.3(RED_CATHODE)
N$172: CHIP_1.P51(G8) D53.1(GREEN_CATHODE)
N$173: CHIP_1.P46(R9) D54.3(RED_CATHODE)
N$174: CHIP_1.P36(G10) D50.1(GREEN_CATHODE)
N$175: CHIP_1.P38(B10) D50.4(BLUE_CATHODE)
N$176: CHIP_1.P32(B11) D52.4(BLUE_CATHODE)
N$177: CHIP_1.P34(R15) D57.3(RED_CATHODE)
N$178: CHIP_1.P33(G15) D57.1(GREEN_CATHODE)
N$179: CHIP_1.P35(B15) D57.4(BLUE_CATHODE)
N$180: CHIP_1.P40(R14) D49.3(RED_CATHODE)
N$181: CHIP_1.P41(B14) D49.4(BLUE_CATHODE)
N$182: CHIP_1.P43(R13) D61.3(RED_CATHODE)
N$183: CHIP_1.P42(G13) D61.1(GREEN_CATHODE)
N$184: CHIP_1.P44(B13) D61.4(BLUE_CATHODE)
N$185: CHIP_1.P50(B12) D62.4(BLUE_CATHODE)
N$186: CHIP_1.P49(R12) D62.3(RED_CATHODE)
N$187: CHIP_1.P39(G14) D49.1(GREEN_CATHODE)
N$188: CHIP_1.P48(G12) D62.1(GREEN_CATHODE)
N$189: CHIP_2.P8(R0) D74.3(RED_CATHODE)
N$190: CHIP_2.P7(B0) D74.4(BLUE_CATHODE)
N$191: CHIP_2.P17(R2) D71.3(RED_CATHODE)
N$192: CHIP_2.P18(G2) D71.1(GREEN_CATHODE)
N$193: CHIP_2.P16(B2) D71.4(BLUE_CATHODE)
N$194: CHIP_2.P14(R1) D75.3(RED_CATHODE)
N$195: CHIP_2.P15(G1) D75.1(GREEN_CATHODE)
N$196: CHIP_2.P13(B1) D75.4(BLUE_CATHODE)
N$197: CHIP_2.P26(R7) D76.3(RED_CATHODE)
N$198: CHIP_2.P27(G7) D76.1(GREEN_CATHODE)
N$199: CHIP_2.P25(B7) D76.4(BLUE_CATHODE)
N$200: CHIP_2.P11(R5) D72.3(RED_CATHODE)
N$201: CHIP_2.P12(G5) D72.1(GREEN_CATHODE)
N$202: CHIP_2.P10(B5) D72.4(BLUE_CATHODE)
N$203: CHIP_2.P20(R6) D67.3(RED_CATHODE)
N$204: CHIP_2.P21(G6) D67.1(GREEN_CATHODE)
N$205: CHIP_2.P19(B6) D67.4(BLUE_CATHODE)
N$206: CHIP_2.P4(B4) D80.4(BLUE_CATHODE)
N$207: CHIP_2.P6(G4) D80.1(GREEN_CATHODE)
N$208: CHIP_2.P5(R4) D80.3(RED_CATHODE)
N$209: CHIP_2.P23(R3) D79.3(RED_CATHODE)
N$210: CHIP_2.P24(G3) D79.1(GREEN_CATHODE)
N$211: CHIP_2.P22(B3) D79.4(BLUE_CATHODE)
N$212: CHIP_2.P53(B8) D69.4(BLUE_CATHODE)
N$213: CHIP_2.P52(R8) D69.3(RED_CATHODE)
N$214: CHIP_2.P47(B9) D70.4(BLUE_CATHODE)
N$215: CHIP_2.P45(G9) D70.1(GREEN_CATHODE)
N$216: CHIP_2.P37(R10) D66.3(RED_CATHODE)
N$217: CHIP_2.P30(G11) D68.1(GREEN_CATHODE)
N$218: CHIP_2.P31(R11) D68.3(RED_CATHODE)
N$219: CHIP_2.P51(G8) D69.1(GREEN_CATHODE)
N$220: CHIP_2.P46(R9) D70.3(RED_CATHODE)
N$221: CHIP_2.P36(G10) D66.1(GREEN_CATHODE)
N$222: CHIP_2.P38(B10) D66.4(BLUE_CATHODE)
N$223: CHIP_2.P32(B11) D68.4(BLUE_CATHODE)
N$224: CHIP_2.P34(R15) D73.3(RED_CATHODE)
N$225: CHIP_2.P33(G15) D73.1(GREEN_CATHODE)
N$226: CHIP_2.P35(B15) D73.4(BLUE_CATHODE)
N$227: CHIP_2.P40(R14) D65.3(RED_CATHODE)
N$228: CHIP_2.P41(B14) D65.4(BLUE_CATHODE)
N$229: CHIP_2.P43(R13) D77.3(RED_CATHODE)
N$230: CHIP_2.P42(G13) D77.1(GREEN_CATHODE)
N$231: CHIP_2.P44(B13) D77.4(BLUE_CATHODE)
N$232: CHIP_2.P50(B12) D78.4(BLUE_CATHODE)
N$233: CHIP_2.P49(R12) D78.3(RED_CATHODE)
N$234: CHIP_2.P39(G14) D65.1(GREEN_CATHODE)
N$235: CHIP_2.P48(G12) D78.1(GREEN_CATHODE)
N$236: CHIP_3.P8(R0) D90.3(RED_CATHODE)
N$237: CHIP_3.P7(B0) D90.4(BLUE_CATHODE)
N$238: CHIP_3.P17(R2) D87.3(RED_CATHODE)
N$239: CHIP_3.P18(G2) D87.1(GREEN_CATHODE)
N$240: CHIP_3.P16(B2) D87.4(BLUE_CATHODE)
N$241: CHIP_3.P14(R1) D91.3(RED_CATHODE)
N$242: CHIP_3.P15(G1) D91.1(GREEN_CATHODE)
N$243: CHIP_3.P13(B1) D91.4(BLUE_CATHODE)
N$244: CHIP_3.P26(R7) D92.3(RED_CATHODE)
N$245: CHIP_3.P27(G7) D92.1(GREEN_CATHODE)
N$246: CHIP_3.P25(B7) D92.4(BLUE_CATHODE)
N$247: CHIP_3.P11(R5) D88.3(RED_CATHODE)
N$248: CHIP_3.P12(G5) D88.1(GREEN_CATHODE)
N$249: CHIP_3.P10(B5) D88.4(BLUE_CATHODE)
N$250: CHIP_3.P20(R6) D83.3(RED_CATHODE)
N$251: CHIP_3.P21(G6) D83.1(GREEN_CATHODE)
N$252: CHIP_3.P19(B6) D83.4(BLUE_CATHODE)
N$253: CHIP_3.P4(B4) D96.4(BLUE_CATHODE)
N$254: CHIP_3.P6(G4) D96.1(GREEN_CATHODE)
N$255: CHIP_3.P5(R4) D96.3(RED_CATHODE)
N$256: CHIP_3.P23(R3) D95.3(RED_CATHODE)
N$257: CHIP_3.P24(G3) D95.1(GREEN_CATHODE)
N$258: CHIP_3.P22(B3) D95.4(BLUE_CATHODE)
N$259: CHIP_3.P53(B8) D85.4(BLUE_CATHODE)
N$260: CHIP_3.P52(R8) D85.3(RED_CATHODE)
N$261: CHIP_3.P47(B9) D86.4(BLUE_CATHODE)
N$262: CHIP_3.P45(G9) D86.1(GREEN_CATHODE)
N$263: CHIP_3.P37(R10) D82.3(RED_CATHODE)
N$264: CHIP_3.P30(G11) D84.1(GREEN_CATHODE)
N$265: CHIP_3.P31(R11) D84.3(RED_CATHODE)
N$266: CHIP_3.P51(G8) D85.1(GREEN_CATHODE)
N$267: CHIP_3.P46(R9) D86.3(RED_CATHODE)
N$268: CHIP_3.P36(G10) D82.1(GREEN_CATHODE)
N$269: CHIP_3.P38(B10) D82.4(BLUE_CATHODE)
N$270: CHIP_3.P32(B11) D84.4(BLUE_CATHODE)
N$271: CHIP_3.P34(R15) D89.3(RED_CATHODE)
N$272: CHIP_3.P33(G15) D89.1(GREEN_CATHODE)
N$273: CHIP_3.P35(B15) D89.4(BLUE_CATHODE)
N$274: CHIP_3.P40(R14) D81.3(RED_CATHODE)
N$275: CHIP_3.P41(B14) D81.4(BLUE_CATHODE)
N$276: CHIP_3.P43(R13) D93.3(RED_CATHODE)
N$277: CHIP_3.P42(G13) D93.1(GREEN_CATHODE)
N$278: CHIP_3.P44(B13) D93.4(BLUE_CATHODE)
N$279: CHIP_3.P50(B12) D94.4(BLUE_CATHODE)
N$280: CHIP_3.P49(R12) D94.3(RED_CATHODE)
N$281: CHIP_3.P39(G14) D81.1(GREEN_CATHODE)
N$282: CHIP_3.P48(G12) D94.1(GREEN_CATHODE)
N$283: CHIP_3.P28(SOUT) CHIP_4.P1(SIN) SOUT3.1
N$285: CHIP_5.P28(SOUT) CHIP_6.P1(SIN) SOUT5.1
N$286: CHIP_4.P28(SOUT) CHIP_5.P1(SIN) SOUT4.1
N$287: CHIP_1.P28(SOUT) CHIP_2.P1(SIN) SOUT1.1
N$288: CHIP_3.P9(G0) D90.1(GREEN_CATHODE)
N$289: CHIP_5.P9(G0) D42.1(GREEN_CATHODE)
N$290: CHIP_4.P9(G0) D26.1(GREEN_CATHODE)
N$291: CHIP_2.P28(SOUT) CHIP_3.P1(SIN) SOUT2.1
N$293: CHIP_6.P9(G0) D10.1(GREEN_CATHODE)
N$298: CHIP_2.P9(G0) D74.1(GREEN_CATHODE)
N$300: CHIP_1.P9(G0) D58.1(GREEN_CATHODE)
SCLK: CHIP_1.P2(SCLK) CHIP_2.P2(SCLK) CHIP_3.P2(SCLK) CHIP_4.P2(SCLK) CHIP_5.P2(SCLK) CHIP_6.P2(SCLK) INPUT.3 OUTPUT.3
VCC: C1.2 C2.2 C3.2 C4.2 C5.2 C6.2 CHIP_1.P54(VCC) CHIP_2.P54(VCC) CHIP_3.P54(VCC) CHIP_4.P54(VCC) CHIP_5.P54(VCC) CHIP_6.P54(VCC) D1.2(CATHODE) D2.2(CATHODE) D3.2(CATHODE) D4.2(CATHODE) D5.2(CATHODE) D6.2(CATHODE) D7.2(CATHODE) D8.2(CATHODE) D9.2(CATHODE) D10.2(CATHODE) D11.2(CATHODE) D12.2(CATHODE) D13.2(CATHODE) D14.2(CATHODE) D15.2(CATHODE) D16.2(CATHODE) D17.2(CATHODE) D18.2(CATHODE) D19.2(CATHODE) D20.2(CATHODE) D21.2(CATHODE) D22.2(CATHODE) D23.2(CATHODE) D24.2(CATHODE) D25.2(CATHODE) D26.2(CATHODE) D27.2(CATHODE) D28.2(CATHODE) D29.2(CATHODE) D30.2(CATHODE) D31.2(CATHODE) D32.2(CATHODE) D33.2(CATHODE) D34.2(CATHODE) D35.2(CATHODE) D36.2(CATHODE) D37.2(CATHODE) D38.2(CATHODE) D39.2(CATHODE) D40.2(CATHODE) D41.2(CATHODE) D42.2(CATHODE) D43.2(CATHODE) D44.2(CATHODE) D45.2(CATHODE) D46.2(CATHODE) D47.2(CATHODE) D48.2(CATHODE) D49.2(CATHODE) D50.2(CATHODE) D51.2(CATHODE) D52.2(CATHODE) D53.2(CATHODE) D54.2(CATHODE) D55.2(CATHODE) D56.2(CATHODE) D57.2(CATHODE) D58.2(CATHODE) D59.2(CATHODE) D60.2(CATHODE) D61.2(CATHODE) D62.2(CATHODE) D63.2(CATHODE) D64.2(CATHODE) D65.2(CATHODE) D66.2(CATHODE) D67.2(CATHODE) D68.2(CATHODE) D69.2(CATHODE) D70.2(CATHODE) D71.2(CATHODE) D72.2(CATHODE) D73.2(CATHODE) D74.2(CATHODE) D75.2(CATHODE) D76.2(CATHODE) D77.2(CATHODE) D78.2(CATHODE) D79.2(CATHODE) D80.2(CATHODE) D81.2(CATHODE) D82.2(CATHODE) D83.2(CATHODE) D84.2(CATHODE) D85.2(CATHODE) D86.2(CATHODE) D87.2(CATHODE) D88.2(CATHODE) D89.2(CATHODE) D90.2(CATHODE) D91.2(CATHODE) D92.2(CATHODE) D93.2(CATHODE) D94.2(CATHODE) D95.2(CATHODE) D96.2(CATHODE) U$1.P$2(VCC)

## Notes on the sheet
- 1
- 6
- 2
- 5
- 4 | 3

## Library data of the parts
C1-C6 = SparkFun-Capacitors:0.1UF-25V(+80/-20%)(0603): CAP-00810 Ceramic Standard decoupling cap; PROD_ID: CAP-00810
CHIP_1-CHIP_6 = ZacksLib:TLC5955
D1-D96 = WallerLabLib:LED-RGB-CC-THRU: RGB Through-hole common cathode LED SparkFun Storefront: COM-00105 (Clear) COM-09264 (Diffuse); PROD_ID: DIO-08418
INPUT OUTPUT = SparkFun-Connectors:M05: Header 5 Standard 5-pin 0.1" header. Use with straight break away headers (SKU : PRT-00116), right angle break away headers (PRT-00553), swiss pins (PRT-00743), machine pins (PRT-00117), and female headers (PRT-00115). Molex polarized connector foot print use with SKU : PRT-08230 with associated crimp pins and housings.
SOUT1-SOUT6 = SparkFun-Connectors:M02: Standard 2-pin 0.1" header. Use with - straight break away headers ( PRT-00116) - right angle break away headers (PRT-00553) - swiss pins (PRT-00743) - machine pins (PRT-00117) - female headers (PRT-00115) Molex polarized connector foot print use with: PRT-08233 with associated crimp pins and housings. 2.54_SCREWTERM for use with PRT-10571. 3.5mm Screw Terminal footprints for PRT-08084 5mm Screw Terminal footprints for use with PRT-08432
U$1 = WallerLabLib:2PIN_PWR